# EAGLE schematic Hack for Good 2020 (EAGLE 9.6.0)
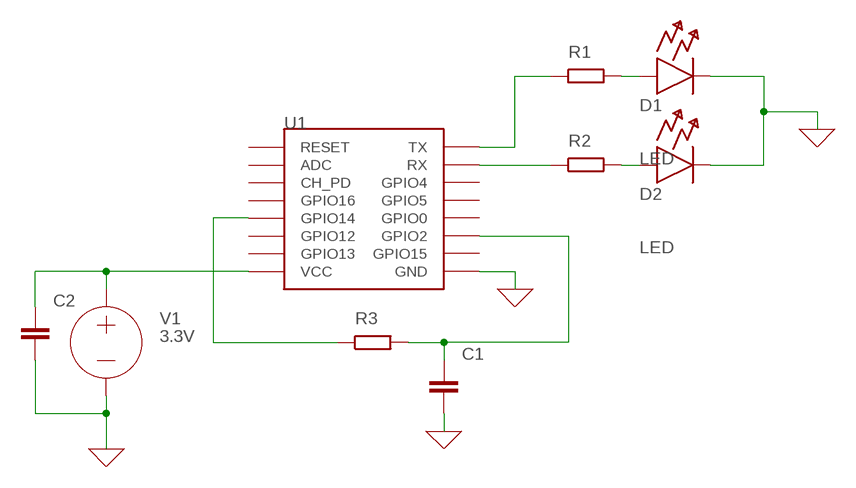
[diagram p0: schematic, sheet 1]

## Parts
C1  C  (no package)
C2  C  (no package)
D1  LED  (no package)
D2  LED  (no package)
R1  R  (no package)
R2  R  (no package)
R3  R  (no package)
U1  ESP12  [ESP12]
V1  3.3V  VOLTAGE  (no package)

## Nets
0: C1.2 C2.2 D1.C D2.C U1.GND V1.- ; supply symbol labelled GND
N$2: R1.1 U1.TX
N$3: D1.A R1.2
N$4: R2.1 U1.RX
N$5: D2.A R2.2
N$6: C2.1 U1.VCC V1.+
N$7: R3.1 U1.GPIO14
N$8: C1.1 R3.2 U1.GPIO2
Unconnected: U1.ADC U1.CH_PD U1.GPIO0 U1.GPIO4 U1.GPIO5 U1.GPIO12 U1.GPIO13 U1.GPIO15 U1.GPIO16 U1.RESET

## Library data of the parts
C1 C2 = ngspice-simulation:C: CAPACITOR
D1 D2 = ngspice-simulation:LED: Diode
R1-R3 = ngspice-simulation:R: RESISTOR
U1 = esp8266modules:ESP12: ESP8266 Wifi module 12
V1 = ngspice-simulation:VOLTAGE: Independent Voltage Source, either DC, AC, PULSE, SINE, PWL, EXP, or SFFM; VALUE: 0V

## Module ESP8266
Ports: 

### Library data of the parts